# EAGLE design Template_V0.1 (EAGLE 7.2.0)
CNAME: EARS PocketQube Template; CREVISION: 0.1; DESIGNER: M. Isbell & L. Stant
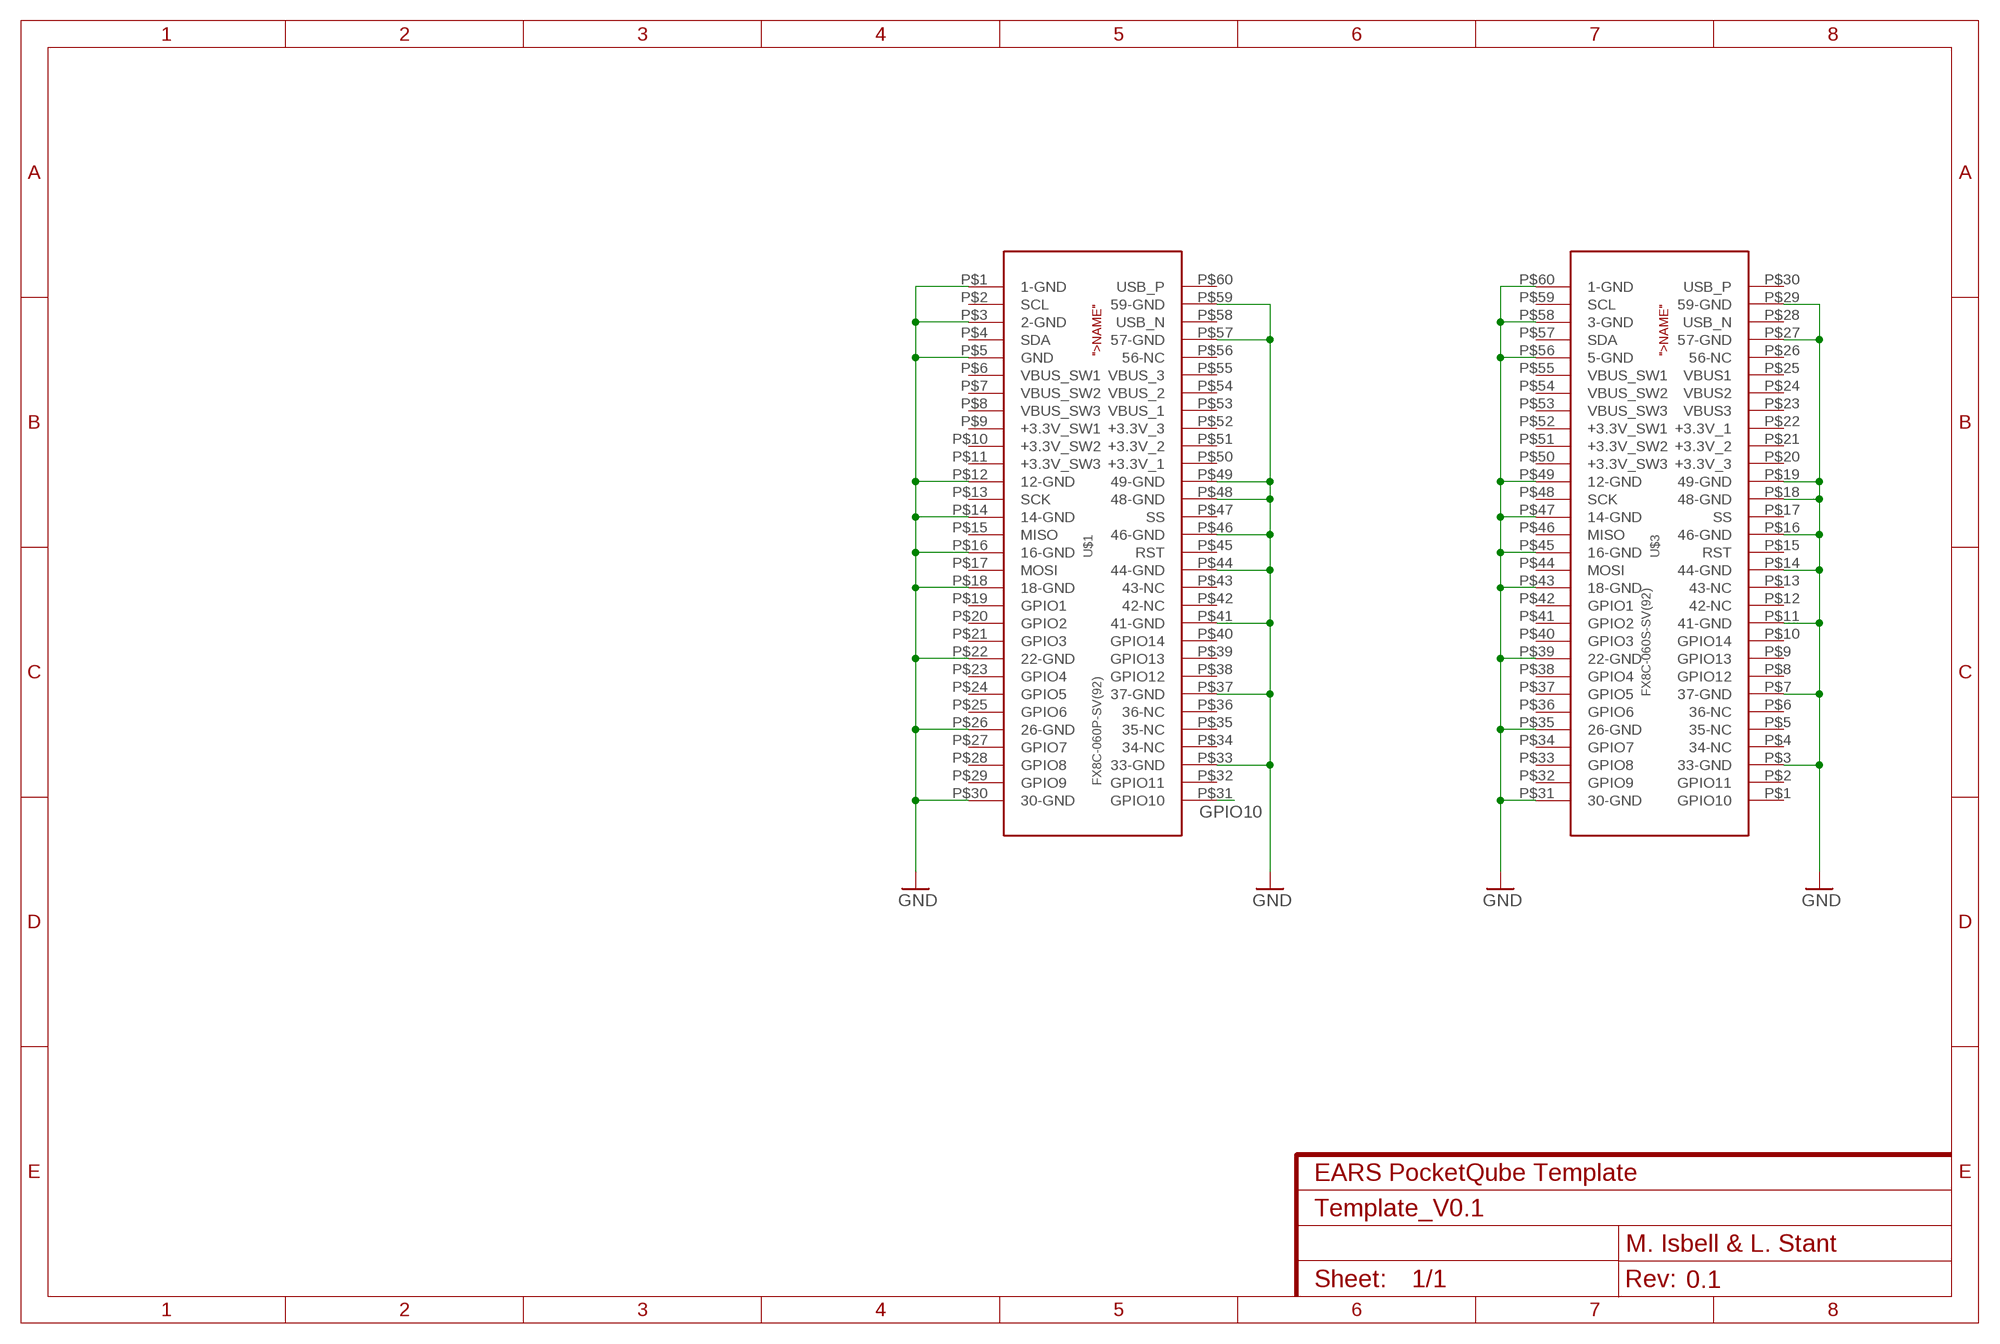
[diagram p0: schematic, sheet 1]

## Parts
U$1  FX8C-060P-SV(92)  [FX8C-060P-SV(92)]
U$3  FX8C-060S-SV(92)  [FX8C-060S-SV(92)]

## Nets
GND: U$1.P$1(1-GND) U$1.P$3(2-GND) U$1.P$5(GND) U$1.P$12(12-GND) U$1.P$14(14-GND) U$1.P$16(16-GND) U$1.P$18(18-GND) U$1.P$22(22-GND) U$1.P$26(26-GND) U$1.P$30(30-GND) U$1.P$33(33-GND) U$1.P$37(37-GND) U$1.P$41(41-GND) U$1.P$44(44-GND) U$1.P$46(46-GND) U$1.P$48(48-GND) U$1.P$49(49-GND) U$1.P$57(57-GND) U$1.P$59(59-GND) U$3.P$3(33-GND) U$3.P$7(37-GND) U$3.P$11(41-GND) U$3.P$14(44-GND) U$3.P$16(46-GND) U$3.P$18(48-GND) U$3.P$19(49-GND) U$3.P$27(57-GND) U$3.P$29(59-GND) U$3.P$31(30-GND) U$3.P$35(26-GND) U$3.P$39(22-GND) U$3.P$43(18-GND) U$3.P$45(16-GND) U$3.P$47(14-GND) U$3.P$49(12-GND) U$3.P$56(5-GND) U$3.P$58(3-GND) U$3.P$60(1-GND)
GPIO10: U$1.P$31(GPIO10)
Unconnected: U$1.P$2(SCL) U$1.P$4(SDA) U$1.P$13(SCK) U$1.P$15(MISO) U$1.P$17(MOSI) U$1.P$19(GPIO1) U$1.P$20(GPIO2) U$1.P$21(GPIO3) U$1.P$23(GPIO4) U$1.P$24(GPIO5) U$1.P$25(GPIO6) U$1.P$27(GPIO7) U$1.P$28(GPIO8) U$1.P$29(GPIO9) U$1.P$32(GPIO11) U$1.P$34(34-NC) U$1.P$35(35-NC) U$1.P$36(36-NC) U$1.P$38(GPIO12) U$1.P$39(GPIO13) U$1.P$40(GPIO14) U$1.P$42(42-NC) U$1.P$43(43-NC) U$1.P$45(RST) U$1.P$47(SS) U$1.P$56(56-NC) U$1.P$58(USB_N) U$1.P$60(USB_P) U$3.P$1(GPIO10) U$3.P$2(GPIO11) U$3.P$4(34-NC) U$3.P$5(35-NC) U$3.P$6(36-NC) U$3.P$8(GPIO12) U$3.P$9(GPIO13) U$3.P$10(GPIO14) U$3.P$12(42-NC) U$3.P$13(43-NC) U$3.P$15(RST) U$3.P$17(SS) U$3.P$23(VBUS3) U$3.P$25(VBUS1) U$3.P$26(56-NC) U$3.P$28(USB_N) U$3.P$30(USB_P) U$3.P$32(GPIO9) U$3.P$33(GPIO8) U$3.P$34(GPIO7) U$3.P$36(GPIO6) U$3.P$37(GPIO5) U$3.P$38(GPIO4) U$3.P$40(GPIO3) U$3.P$41(GPIO2) U$3.P$42(GPIO1) U$3.P$44(MOSI) U$3.P$46(MISO) U$3.P$48(SCK) U$3.P$57(SDA) U$3.P$59(SCL)

## Power pins joined to a net without a drawn wire
+3.3V_1: U$1.P$50(+3.3V_1) U$3.P$22(+3.3V_1)
+3.3V_2: U$1.P$51(+3.3V_2) U$3.P$21(+3.3V_2)
+3.3V_3: U$1.P$52(+3.3V_3) U$3.P$20(+3.3V_3)
+3.3V_SW1: U$1.P$9(+3.3V_SW1) U$3.P$52(+3.3V_SW1)
+3.3V_SW2: U$1.P$10(+3.3V_SW2) U$3.P$51(+3.3V_SW2)
+3.3V_SW3: U$1.P$11(+3.3V_SW3) U$3.P$50(+3.3V_SW3)
VBUS2: U$3.P$24(VBUS2)
VBUS_1: U$1.P$53(VBUS_1)
VBUS_2: U$1.P$54(VBUS_2)
VBUS_3: U$1.P$55(VBUS_3)
VBUS_SW1: U$1.P$6(VBUS_SW1) U$3.P$55(VBUS_SW1)
VBUS_SW2: U$1.P$7(VBUS_SW2) U$3.P$54(VBUS_SW2)
VBUS_SW3: U$1.P$8(VBUS_SW3) U$3.P$53(VBUS_SW3)

## Library data of the parts
U$1 = PQ_components:FX8C-060P-SV(92): FX8C-060P-SV(92) Hirose plug, for use in the PocketQube Standard boards. Device model created 10/2/14 By Stuart McAndrew AKA OzQube-1 Twitter - @ssshocker
U$3 = PQ_components:FX8C-060S-SV(92): This is the bottom connector for a standard PocketQube board. Created by Stuart McAndrew AKA OzQube-1 17/2/14

## Board
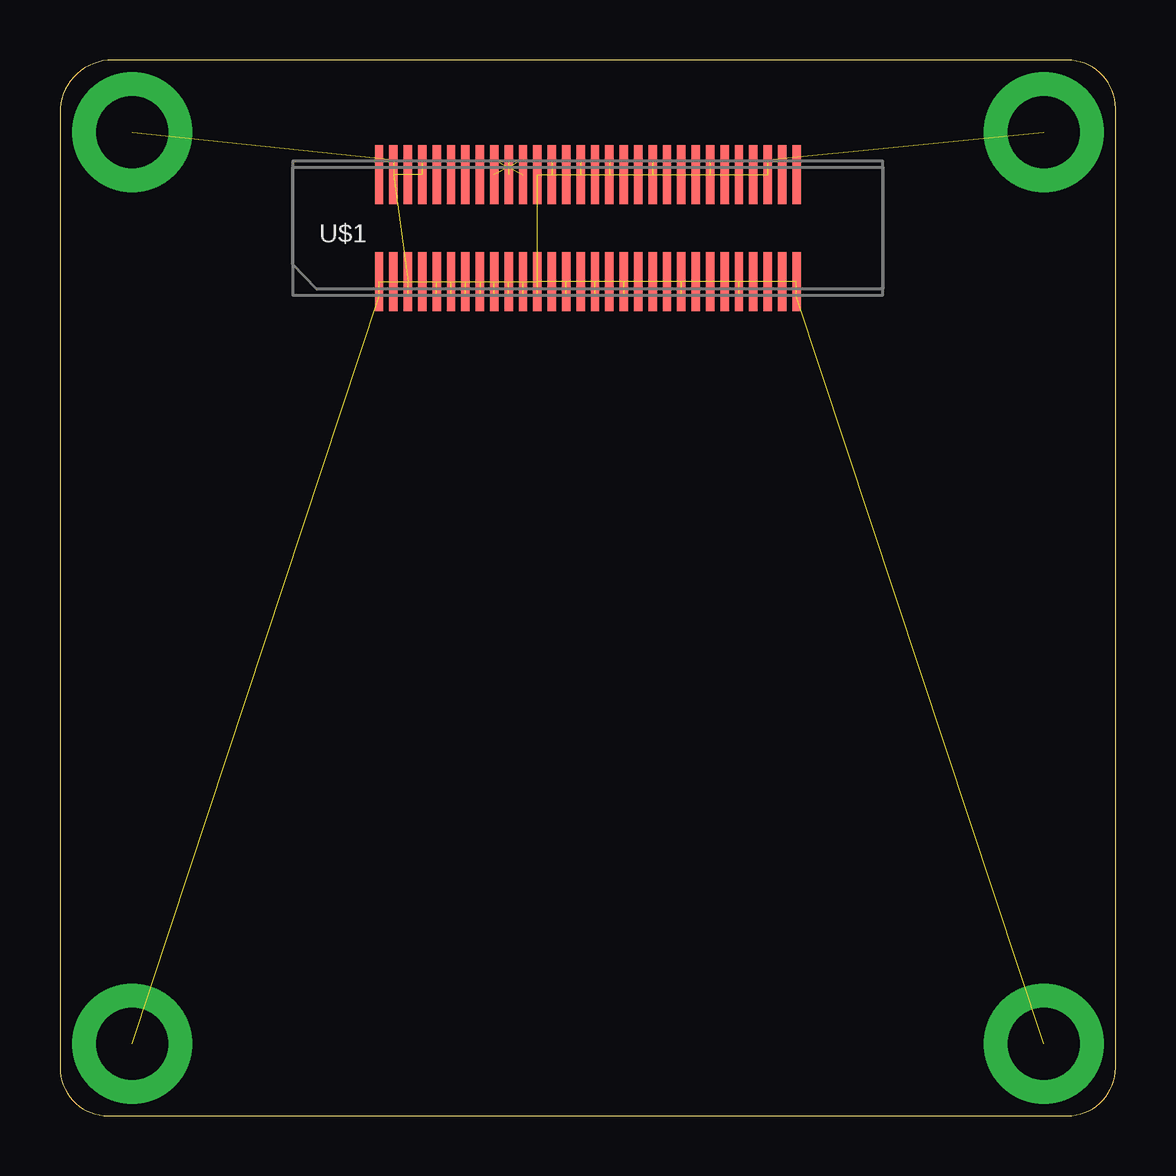
[diagram p1: board, top side]
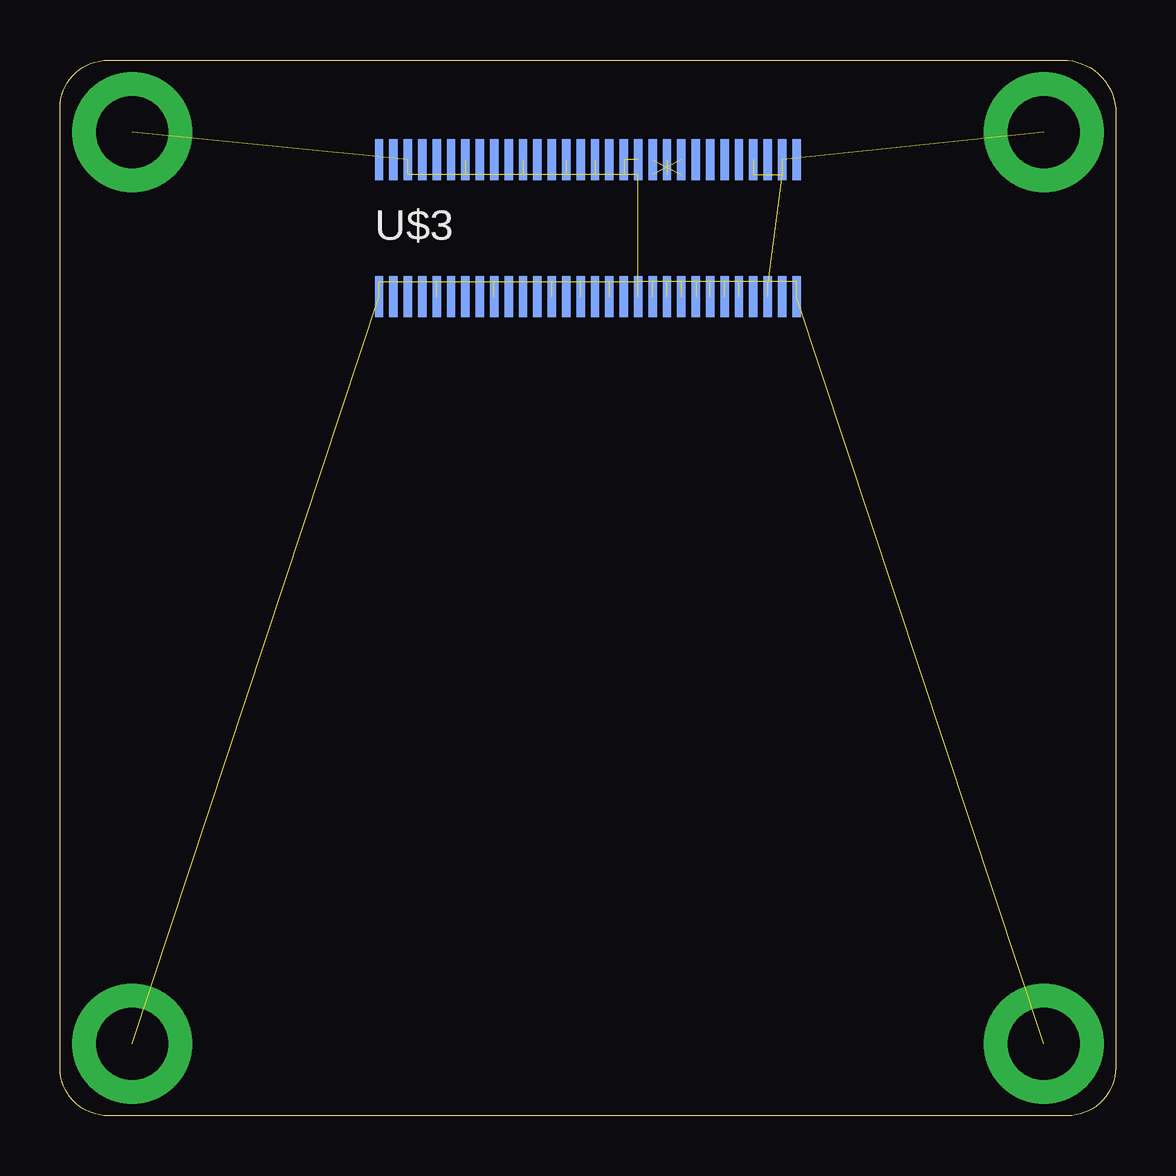
[diagram p2: board, bottom side, seen from below]

Size 44 x 44.01 mm. Coordinates in mm from the lower left corner, seen from the top.
Outline: 2,0 42,0 arc90 44,2 44,42 arc90 42,44 2.4,44 arc90 0,42 0,2 arc90 2,0
Copper layers (1*16): Top 0.035mm / dielectric 1.5mm / Bottom 0.035mm
Design rules "SeeedStudio_2layer_DRU_no_angle_20140221": minimum track width 6mil, minimum drill 12mil, track to track 6mil, track to pad 6mil, pad to pad 6mil, via to via 6mil, smd to smd 0mil, copper to edge 10mil, drill to drill 10mil, minimum pad ring 10mil, minimum via ring 6mil, stop-mask expansion 2mil, vias tented up to drill 100mil, thermal gap 10mil

### Footprints (pad centres in the part's own frame; a part is rotated, then mirrored left to right if it is on the bottom)
FX8C-060P-SV(92) = smd 0.35 x 2.45: P$1 -8.7,-2.225; P$2 -8.1,-2.225; P$3 -7.5,-2.225; P$4 -6.9,-2.225; P$5 -6.3,-2.225; P$6 -5.7,-2.225; P$7 -5.1,-2.225; P$8 -4.5,-2.225; P$9 -3.9,-2.225; P$10 -3.3,-2.225; P$11 -2.7,-2.225; P$12 -2.1,-2.225; P$13 -1.5,-2.225; P$14 -0.9,-2.225; P$15 -0.3,-2.225; P$16 0.3,-2.225; P$17 0.9,-2.225; P$18 1.5,-2.225; P$19 2.1,-2.225; P$20 2.7,-2.225; P$21 3.3,-2.225; P$22 3.9,-2.225; P$23 4.5,-2.225; P$24 5.1,-2.225; P$25 5.7,-2.225; P$26 6.3,-2.225; P$27 6.9,-2.225; P$28 7.5,-2.225; P$29 8.1,-2.225; P$30 8.7,-2.225; P$31 8.7,2.225; P$32 8.1,2.225; P$33 7.5,2.225; P$34 6.9,2.225; P$35 6.3,2.225; P$36 5.7,2.225; P$37 5.1,2.225; P$38 4.5,2.225; P$39 3.9,2.225; P$40 3.3,2.225; P$41 2.7,2.225; P$42 2.1,2.225; P$43 1.5,2.225; P$44 0.9,2.225; P$45 0.3,2.225; P$46 -0.3,2.225; P$47 -0.9,2.225; P$48 -1.5,2.225; P$49 -2.1,2.225; P$50 -2.7,2.225; P$51 -3.3,2.225; P$52 -3.9,2.225; P$53 -4.5,2.225; P$54 -5.1,2.225; P$55 -5.7,2.225; P$56 -6.3,2.225; P$57 -6.9,2.225; P$58 -7.5,2.225; P$59 -8.1,2.225; P$60 -8.7,2.225
FX8C-060S-SV(92) = smd 0.35 x 1.7: P$1 -8.7,2.85; P$2 -8.1,2.85; P$3 -7.5,2.85; P$4 -6.9,2.85; P$5 -6.3,2.85; P$6 -5.7,2.85; P$7 -5.1,2.85; P$8 -4.5,2.85; P$9 -3.9,2.85; P$10 -3.3,2.85; P$11 -2.7,2.85; P$12 -2.1,2.85; P$13 -1.5,2.85; P$14 -0.9,2.85; P$15 -0.3,2.85; P$16 0.3,2.85; P$17 0.9,2.85; P$18 1.5,2.85; P$19 2.1,2.85; P$20 2.7,2.85; P$21 3.3,2.85; P$22 3.9,2.85; P$23 4.5,2.85; P$24 5.1,2.85; P$25 5.7,2.85; P$26 6.3,2.85; P$27 6.9,2.85; P$28 7.5,2.85; P$29 8.1,2.85; P$30 8.7,2.85; P$31 -8.7,-2.85; P$32 -8.1,-2.85; P$33 -7.5,-2.85; P$34 -6.9,-2.85; P$35 -6.3,-2.85; P$36 -5.7,-2.85; P$37 -5.1,-2.85; P$38 -4.5,-2.85; P$39 -3.9,-2.85; P$40 -3.3,-2.85; P$41 -2.7,-2.85; P$42 -2.1,-2.85; P$43 -1.5,-2.85; P$44 -0.9,-2.85; P$45 -0.3,-2.85; P$46 0.3,-2.85; P$47 0.9,-2.85; P$48 1.5,-2.85; P$49 2.1,-2.85; P$50 2.7,-2.85; P$51 3.3,-2.85; P$52 3.9,-2.85; P$53 4.5,-2.85; P$54 5.1,-2.85; P$55 5.7,-2.85; P$56 6.3,-2.85; P$57 6.9,-2.85; P$58 7.5,-2.85; P$59 8.1,-2.85; P$60 8.7,-2.85

### Placement (x,y rotation side)
U$1  22,37 0 top
U$3  22,37 0 bottom

### Tracks (layer width: path | path; a pad name or v marks a point on that pad's centre or on a via)
+3.3V_1  (1 unrouted)
+3.3V_2  (1 unrouted)
+3.3V_3  (1 unrouted)
+3.3V_SW1  (1 unrouted)
+3.3V_SW2  (1 unrouted)
+3.3V_SW3  (1 unrouted)
GND  (via drill 3 pad 5)  (41 unrouted)
  other vias: 3,41 41,41 41,3 3,3
VBUS_SW1  (1 unrouted)
VBUS_SW2  (1 unrouted)
VBUS_SW3  (1 unrouted)